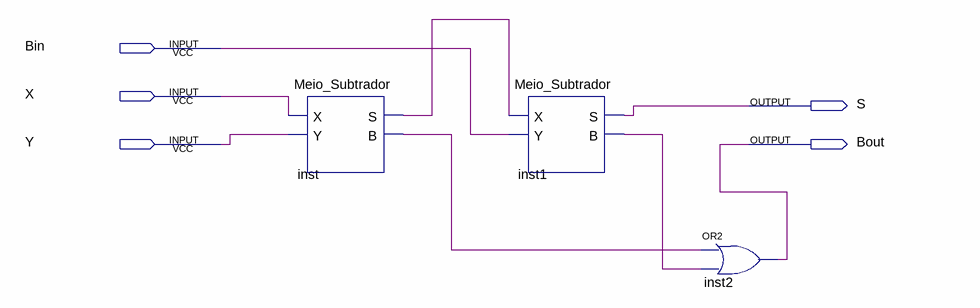
[diagram p0: schematic sheet]
// Quartus schematic Subtrador_Completo.bdf as structural Verilog: 3 symbols, 5 pins
module Subtrador_Completo (
  input  Bin,
  input  X,
  input  Y,
  output S,
  output Bout
);

  wire inst1_b, inst_b, inst_s;

  Meio_Subtrador inst (.X(X), .Y(Y), .S(inst_s), .B(inst_b));
  Meio_Subtrador inst1 (.X(inst_s), .Y(Bin), .S(S), .B(inst1_b));
  or inst2 (Bout, inst_b, inst1_b);
endmodule
